# EAGLE design IOSEC8 (EAGLE 9.5.1)
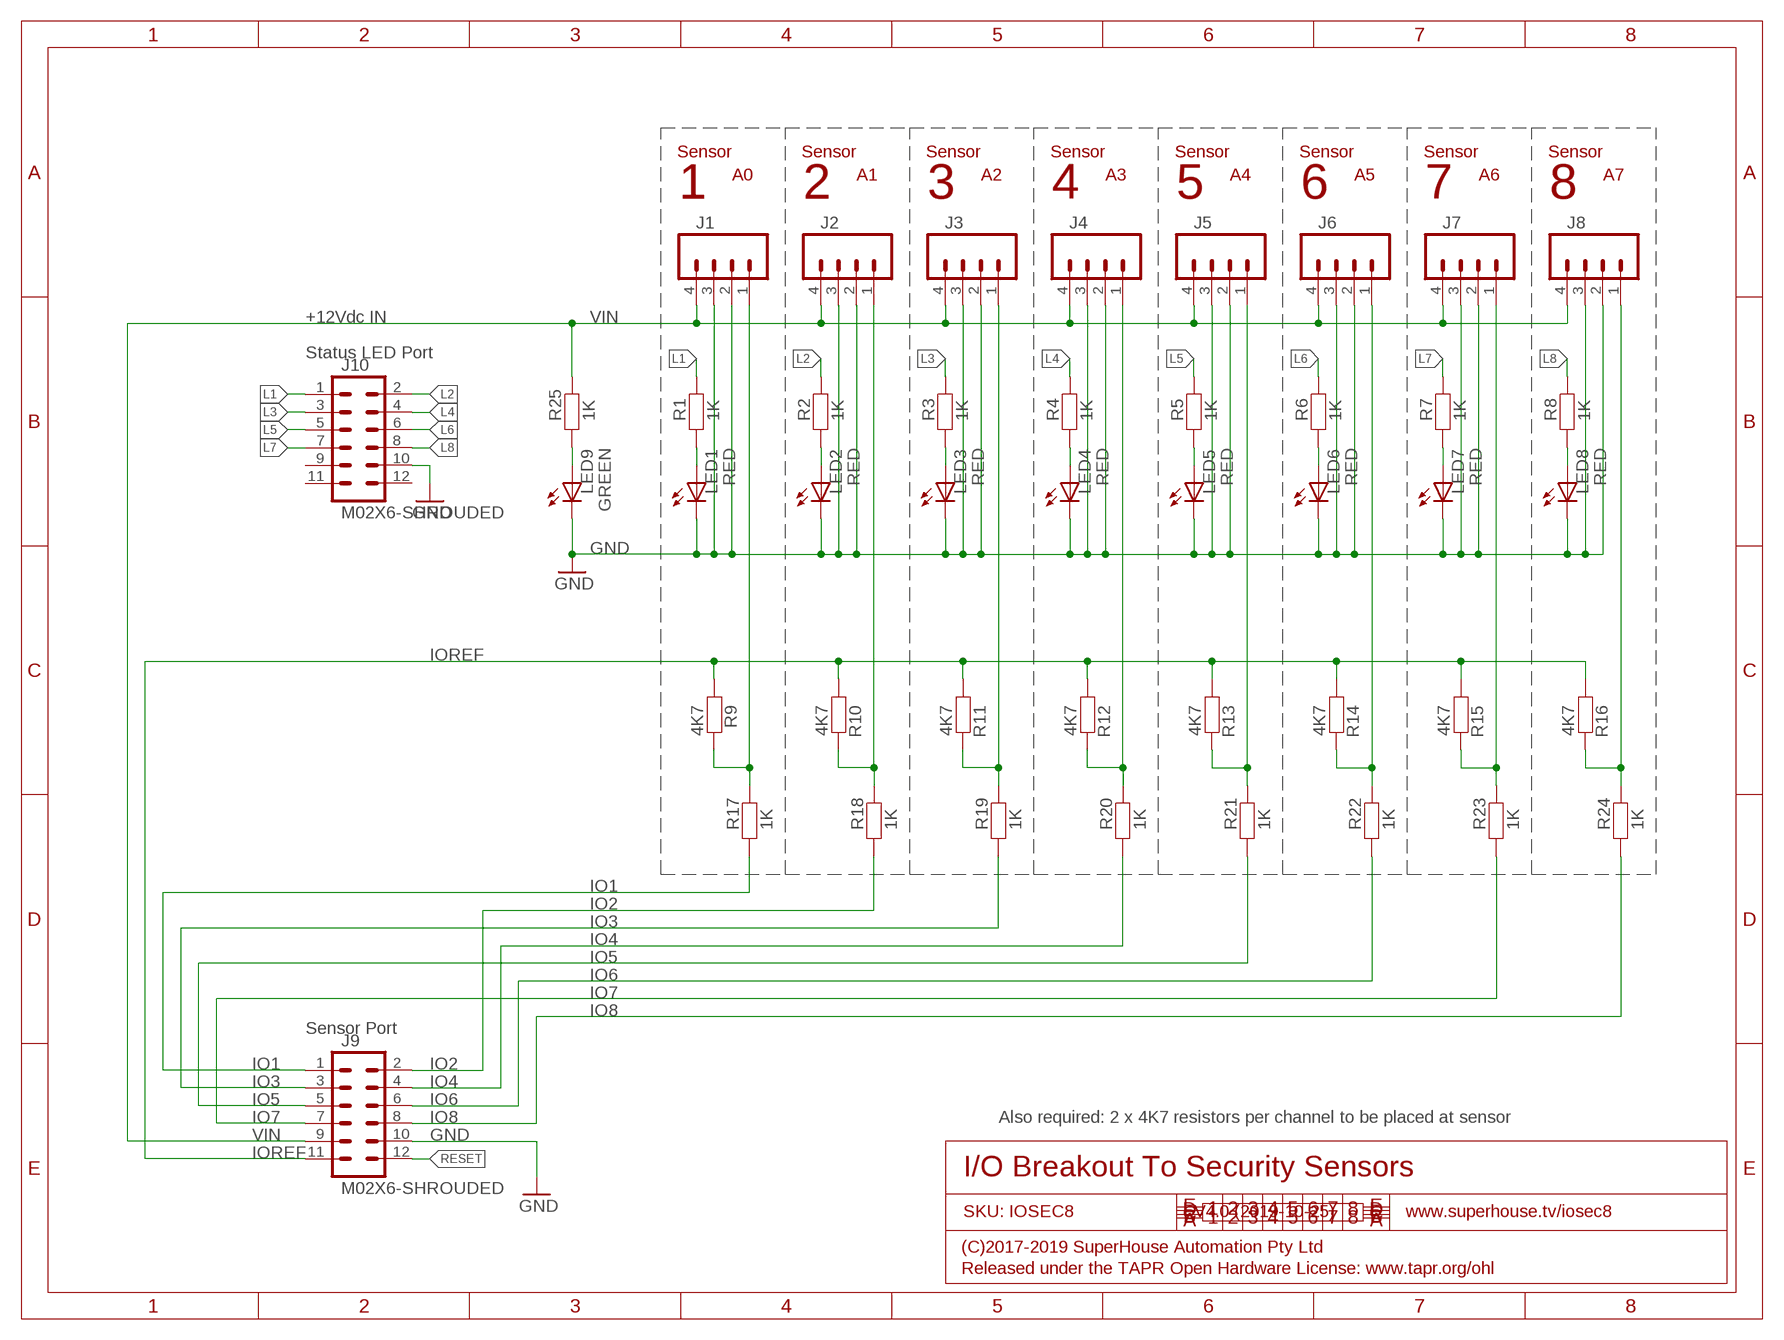
[diagram p0: schematic, sheet 1]

## Parts
J1  M04-SCREW-3.5MM  [SCREWTERMINAL-3.5MM-4]
J2  M04-SCREW-3.5MM  [SCREWTERMINAL-3.5MM-4]
J3  M04-SCREW-3.5MM  [SCREWTERMINAL-3.5MM-4]
J4  M04-SCREW-3.5MM  [SCREWTERMINAL-3.5MM-4]
J5  M04-SCREW-3.5MM  [SCREWTERMINAL-3.5MM-4]
J6  M04-SCREW-3.5MM  [SCREWTERMINAL-3.5MM-4]
J7  M04-SCREW-3.5MM  [SCREWTERMINAL-3.5MM-4]
J8  M04-SCREW-3.5MM  [SCREWTERMINAL-3.5MM-4]
J9  M02X6-SHROUDED  [2X06-SHROUDED]
J10  M02X6-SHROUDED  [2X06-SHROUDED]
LED1  RED  LED0603  [LED-0603]
LED2  RED  LED0603  [LED-0603]
LED3  RED  LED0603  [LED-0603]
LED4  RED  LED0603  [LED-0603]
LED5  RED  LED0603  [LED-0603]
LED6  RED  LED0603  [LED-0603]
LED7  RED  LED0603  [LED-0603]
LED8  RED  LED0603  [LED-0603]
LED9  GREEN  LED0603  [LED-0603]
R1  1K  RESISTOR0603  [R0603]
R2  1K  RESISTOR0603  [R0603]
R3  1K  RESISTOR0603  [R0603]
R4  1K  RESISTOR0603  [R0603]
R5  1K  RESISTOR0603  [R0603]
R6  1K  RESISTOR0603  [R0603]
R7  1K  RESISTOR0603  [R0603]
R8  1K  RESISTOR0603  [R0603]
R9  4K7  RESISTOR0603  [R0603]
R10  4K7  RESISTOR0603  [R0603]
R11  4K7  RESISTOR0603  [R0603]
R12  4K7  RESISTOR0603  [R0603]
R13  4K7  RESISTOR0603  [R0603]
R14  4K7  RESISTOR0603  [R0603]
R15  4K7  RESISTOR0603  [R0603]
R16  4K7  RESISTOR0603  [R0603]
R17  1K  RESISTOR0603  [R0603]
R18  1K  RESISTOR0603  [R0603]
R19  1K  RESISTOR0603  [R0603]
R20  1K  RESISTOR0603  [R0603]
R21  1K  RESISTOR0603  [R0603]
R22  1K  RESISTOR0603  [R0603]
R23  1K  RESISTOR0603  [R0603]
R24  1K  RESISTOR0603  [R0603]
R25  1K  RESISTOR0603  [R0603]

## Nets
GND: J1.2 J1.3 J2.2 J2.3 J3.2 J3.3 J4.2 J4.3 J5.2 J5.3 J6.2 J6.3 J7.2 J7.3 J8.2 J8.3 J9.10 J10.10 LED1.C LED2.C LED3.C LED4.C LED5.C LED6.C LED7.C LED8.C LED9.C
IO1: J9.1 R17.1
IO2: J9.2 R18.1
IO3: J9.3 R19.1
IO4: J9.4 R20.1
IO5: J9.5 R21.1
IO6: J9.6 R22.1
IO7: J9.7 R23.1
IO8: J9.8 R24.1
IOREF: J9.11 R9.1 R10.1 R11.1 R12.1 R13.1 R14.1 R15.1 R16.1
L1: J10.1 R1.2
L2: J10.2 R2.2
L3: J10.3 R3.2
L4: J10.4 R4.2
L5: J10.5 R5.2
L6: J10.6 R6.2
L7: J10.7 R7.2
L8: J10.8 R8.2
N$1: LED9.A R25.1
N$2: LED1.A R1.1
N$3: J2.1 R10.2 R18.2
N$7: J5.1 R13.2 R21.2
N$8: J6.1 R14.2 R22.2
N$9: J7.1 R15.2 R23.2
N$10: J8.1 R16.2 R24.2
N$16: LED2.A R2.1
N$17: LED3.A R3.1
N$18: LED4.A R4.1
N$19: LED5.A R5.1
N$20: LED6.A R6.1
N$21: LED7.A R7.1
N$22: LED8.A R8.1
N$249: J3.1 R11.2 R19.2
N$256: J4.1 R12.2 R20.2
N$262: J1.1 R9.2 R17.2
RESET: J9.12
VIN: J1.4 J2.4 J3.4 J4.4 J5.4 J6.4 J7.4 J8.4 J9.9 R25.2
Unconnected: J10.9 J10.11 J10.12

## Notes on the sheet
- Sensor | Sensor | Sensor | Sensor | Sensor | Sensor | Sensor | Sensor
- A0 | A1 | A2 | A3 | A4 | A5 | A6 | A7
- 1 | 2 | 3 | 4 | 5 | 6 | 7 | 8
- +12Vdc IN
- Status LED Port
- Sensor Port
- Also required: 2 x 4K7 resistors per channel to be placed at sensor
- I/O Breakout To Security Sensors
- SKU: IOSEC8 | V4.0 (2019-10-25) | www.superhouse.tv/iosec8
- (C)2017-2019 SuperHouse Automation Pty Ltd
- Released under the TAPR Open Hardware License: www.tapr.org/ohl

## Library data of the parts
J1-J8 = SuperHouse-Connectors:M04: 4-way header Standard 1x4 header, and screw terminal variations
J9 J10 = SuperHouse-Connectors:M02X6: M12 header in 2x6 format
LED1-LED9 = SuperHouse-LEDs:LED: LEDs Standard schematic elements and footprints for 5mm, 3mm, 1206, and 0603 sized LEDs. 5mm - Spark Fun Electronics SKU : COM-00529 (and others)
R1-R25 = SuperHouse-DiscreteSemi:RESISTOR: Resistor Standard resistors.

## Board
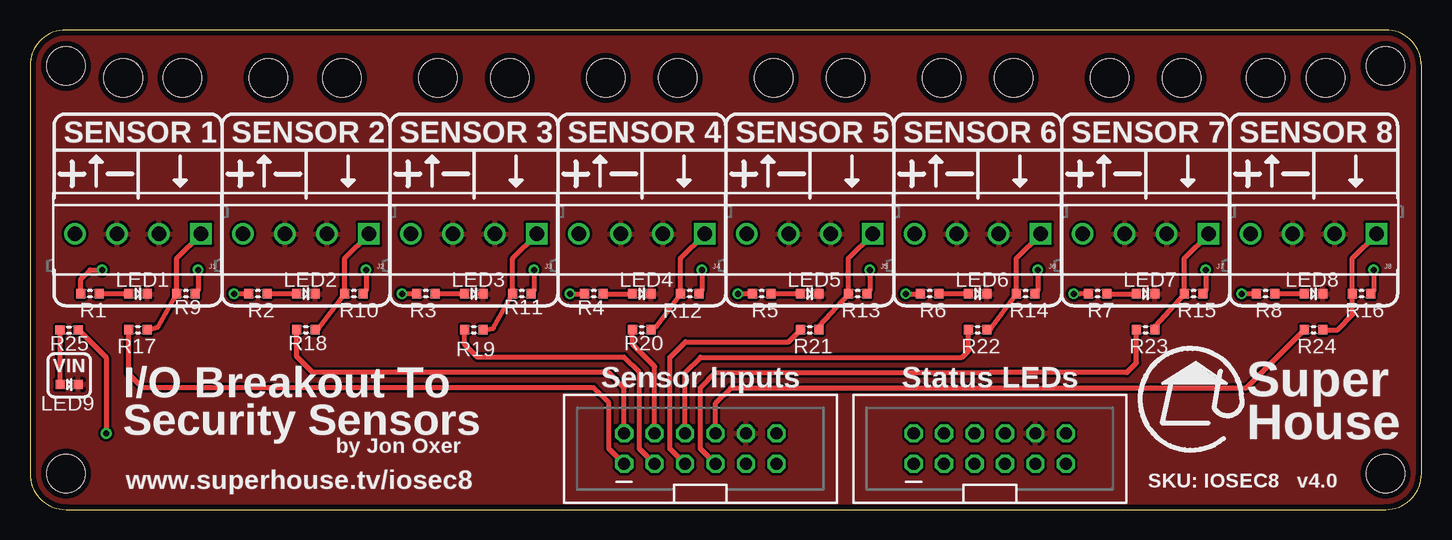
[diagram p1: board, top side]
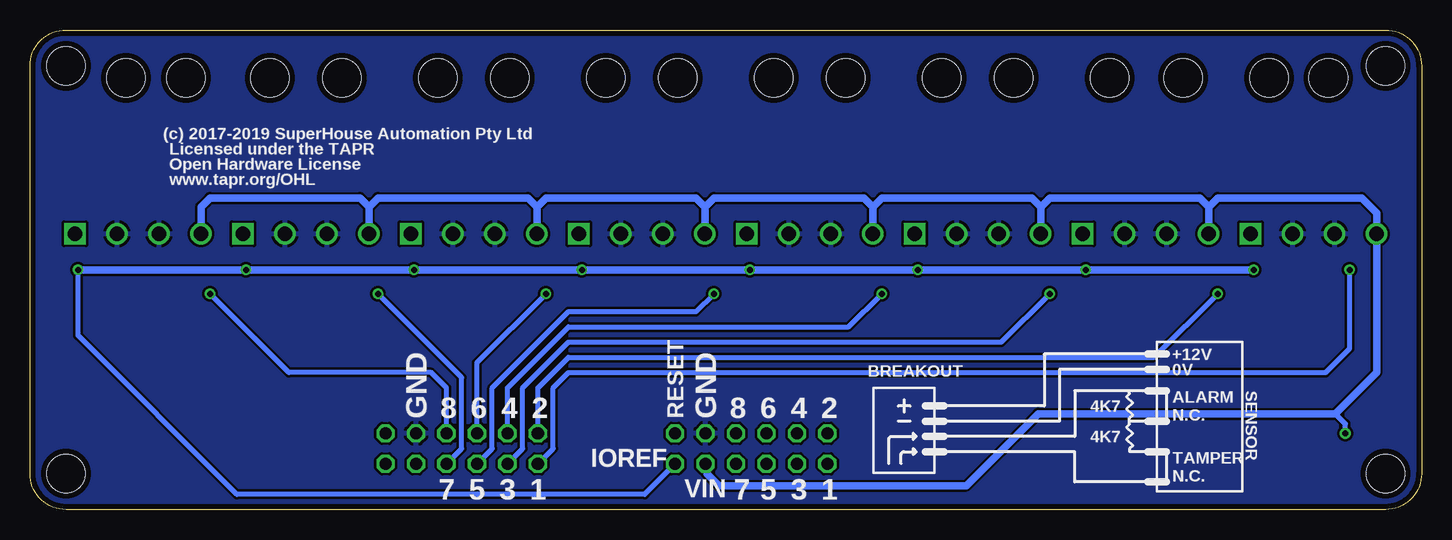
[diagram p2: board, bottom side, seen from below]

Size 116 x 40 mm. Coordinates in mm from the lower left corner, seen from the top.
Outline: 0,3 arc90 3,0 113,0 arc90 116,3 116,37 arc90 113,40 3,40 arc90 0,37 0,3
Copper layers (1*16): Top 0.035mm / dielectric 1.5mm / Bottom 0.035mm
Design rules "SuperHouse-Design-Rules": minimum track width 10mil, minimum drill 24mil, track to track 8mil, track to pad 8mil, pad to pad 8mil, via to via 8mil, smd to smd 6mil, copper to edge 18mil, drill to drill 8mil, minimum pad ring 10mil, minimum via ring 8mil, stop-mask expansion 4mil, vias tented up to drill 0.5mm, thermal gap 10mil
Holes 3.2 mm at 12.7,36 7.77,36 19.86,36 26,36 40,36 34,36 48,36 54,36 68,36 62,36 76,36 82,36 96,36 90,36 103,36 108,36 3,3 113,3 3,37 113,37

### Footprints (pad centres in the part's own frame; a part is rotated, then mirrored left to right if it is on the bottom)
SCREWTERMINAL-3.5MM-4 = drill 1.2 square: 1 -5.25,0 | drill 1.2: 2 -1.75,0; 3 1.75,0; 4 5.25,0
2X06-SHROUDED = drill 1.016 octagon: 1 0,0; 2 2.54,0; 3 0,-2.54; 4 2.54,-2.54; 5 0,-5.08; 6 2.54,-5.08; 7 0,-7.62; 8 2.54,-7.62; 9 0,-10.16; 10 2.54,-10.16; 11 0,-12.7; 12 2.54,-12.7
LED-0603 = smd 0.762 x 0.762: A -0.762,0; C 0.762,0
R0603 = smd 0.762 x 0.762: 1 -0.762,0; 2 0.762,0

### Placement (x,y rotation side)
J1  9,23 180 top
J2  23,23 180 top
J3  37,23 180 top
J4  51,23 180 top
J5  65,23 180 top
J6  79,23 180 top
J7  93,23 180 top
J8  107,23 180 top
J9  49.53,3.81 90 top
J10  73.66,3.81 90 top
LED1  9,18 0 top
LED2  23,18 0 top
LED3  37,18 0 top
LED4  51,18 0 top
LED5  65,18 0 top
LED6  79,18 0 top
LED7  93,18 0 top
LED8  107,18 0 top
LED9  3.27,10.43 0 top
R1  5,18 180 top
R2  19,18 180 top
R3  33,18 180 top
R4  47,18 180 top
R5  61,18 180 top
R6  75,18 180 top
R7  89,18 180 top
R8  103,18 180 top
R9  13,18 180 top
R10  27,18 180 top
R11  41,18 180 top
R12  55,18 180 top
R13  69,18 180 top
R14  83,18 180 top
R15  97,18 180 top
R16  111,18 180 top
R17  9,15 0 top
R18  23,15 0 top
R19  37,15 0 top
R20  51,15 0 top
R21  65,15 0 top
R22  79,15 0 top
R23  93,15 0 top
R24  107,15 0 top
R25  3.26,14.97 0 top

### Tracks (layer width: path | path; a pad name or v marks a point on that pad's centre or on a via)
GND
  pour Bottom: 0,37 arc-90 3,40 113,40 arc-90 116,37 116,3 arc-90 113,0 3,0 arc-74 0,3
  pour Top: 0,37 arc-90 3,40 113,40 arc-90 116,37 116,3 arc-90 113,0 3,0 arc-74 0,3
IO1
  Top 0.406: J9.1 48.26,5.08 48.26,8.89 46.99,10.16 9.39,10.16 8.24,11.31 R17.1
IO2
  Top 0.406: J9.2 49.53,10.16 48.26,11.43 23.57,11.43 22.24,12.76 R18.1
IO3
  Top 0.406: J9.3 50.8,5.08 50.8,11.43 49.53,12.7 39,12.7 38.54,12.7 37.3,12.7 36.24,13.76 R19.1
IO4
  Top 0.406: R20.1 50.24,13.76 52.07,11.93 J9.4
IO5
  Top 0.406: J9.5 53.34,5.08 53.34,12.7 54.64,14 63.24,14 R21.1
IO6
  Top 0.406: J9.6 54.61,11.43 55.88,12.7 77.7,12.7 78.24,13.24 R22.1
IO7
  Top 0.406: J9.7 55.88,5.08 55.88,10.16 57.15,11.43 80,11.43 91.43,11.43 92.24,12.24 R23.1
IO8
  Top 0.406: J9.8 57.15,8.89 58.42,10.16 101.4,10.16 R24.1
IOREF  (via drill 0.5)
  Top 0.305: 14,18.24 R9.1 | 28,18.24 R10.1 | 42,18.24 R11.1 | 56,18.24 R12.1 | 70,18.24 R13.1 | 84,18.24 R14.1 | 98,18.24 R15.1 | 112,18.24 R16.1
  Top 0.406: v14,20 14,18.24 | v28,20 28,18.24 | v42,20 42,18.24 | v56,20 56,18.24 | v70,20 70,18.24 | v84,20 84,18.24 | v98,20 98,18.24 | v112,20 112,18.24
  Bottom 0.406: J9.11 64.77,1.27 98.76,1.27 112,14.51 v112,20
  Bottom 0.61: v14,20 v28,20 v42,20 v56,20 v70,20 v84,20 v98,20 v112,20
L1  (via drill 0.5)
  Top 0.406: R1.2 4.24,19.24 5,20 v6,20
  Bottom 0.406: J10.1 72.39,5.08 72.39,10.16 71.12,11.43 8,11.43 6,13.43 v6,20
L2  (via drill 0.5)
  Top 0.406: R2.2 v17,18
  Bottom 0.406: J10.2 73.66,10.16 71.12,12.7 22.3,12.7 v17,18
L3  (via drill 0.5)
  Top 0.406: R3.2 v31,18
  Bottom 0.406: J10.3 74.93,5.08 74.93,10.16 71.12,13.97 37,13.97 36.45,13.97 35.03,13.97 v31,18
L4  (via drill 0.5)
  Top 0.406: v45,18 R4.2
  Bottom 0.406: J10.4 76.2,10.16 71.12,15.24 47.76,15.24 v45,18
L5  (via drill 0.5)
  Top 0.406: R5.2 v59,18
  Bottom 0.406: J10.5 77.47,5.08 77.47,10.16 71.12,16.51 64,16.51 63.8,16.51 60.49,16.51 v59,18
L6  (via drill 0.5)
  Top 0.406: v73,18 R6.2
  Bottom 0.406: J10.6 78.74,12.26 v73,18
L7  (via drill 0.5)
  Top 0.406: R7.2 87.53,18.02 v87,18
  Bottom 0.406: J10.7 80.01,5.08 80.01,11.01 v87,18
L8  (via drill 0.5)
  Top 0.406: R8.2 v101,18
  Bottom 0.406: J10.8 81.28,10.16 82.55,11.43 94.43,11.43 v101,18
N$1
  Top 0.406: LED9.A R25.1
N$2
  Top 0.406: LED1.A R1.1
N$3
  Top 0.406: R18.2 24.03,15.05 R10.2 26.24,20.99 J2.1
N$7
  Top 0.406: R21.2 65.76,15.3 R13.2 68.24,20.99 J5.1
N$8
  Top 0.406: R22.2 80.08,15.05 R14.2 82.24,20.99 J6.1
N$9
  Top 0.406: R23.2 93.76,15.28 R15.2 96.24,20.99 J7.1
N$10
  Top 0.406: J8.1 110.24,20.99 R16.2 110.24,16.24 109,15 R24.2
N$16
  Top 0.406: LED2.A R2.1
N$17
  Top 0.406: LED3.A R3.1
N$18
  Top 0.406: R4.1 LED4.A
N$19
  Top 0.406: LED5.A R5.1
N$20
  Top 0.406: LED6.A R6.1
N$21
  Top 0.406: R7.1 LED7.A
N$22
  Top 0.406: LED8.A R8.1
N$249
  Top 0.406: R19.2 38.61,15.11 R11.2 40.24,20.99 J3.1
N$256
  Top 0.406: R20.2 52.2,15.24 R12.2 54.24,20.99 J4.1
N$262
  Top 0.406: R17.2 10.67,15.24 R9.2 12.24,20.99 J1.1
VIN  (via drill 0.5)
  Top 0.406: R25.2 4.08,14.97 6.35,12.7 v6.35,6.35
  Bottom 0.406: v6.35,6.35 6.35,7.16 7.19,8
  Bottom 0.61: J9.9 59.57,3.81 59.57,3 58.57,2 37.95,2 31.95,8 7.19,8 3.75,11.44 J1.4 3.75,24.75 5,26 17,26 17.75,25.25 | J4.4 45.75,25.25 | 45.75,25.25 45,26 32.5,26 31.75,25.25 | J5.4 59.75,25.25 | 59.75,25.25 59,26 46.5,26 45.75,25.25 | J6.4 73.75,25.25 | 73.75,25.25 73,26 60.5,26 59.75,25.25 | J7.4 87.75,25.25 | 87.75,25.25 87,26 74.5,26 73.75,25.25 | J8.4 101.75,25.25 101,26 88.5,26 87.75,25.25 | J3.4 31.75,25.25 | 31.75,25.25 31,26 18.5,26 17.75,25.25 | J2.4 17.75,25.25

### Text on the board
tPlace: SENSOR 1 | SENSOR 2 | SENSOR 3 | SENSOR 4 | SENSOR 5 | SENSOR 6 | SENSOR 7 | SENSOR 8 | VIN | Sensor Inputs | Status LEDs | I/O Breakout To / Security Sensors | Super / House | by Jon Oxer | www.superhouse.tv/iosec8 | SKU: IOSEC8 | v4.0
bPlace: (c) 2017-2019 SuperHouse Automation Pty Ltd | Licensed under the TAPR | Open Hardware License | www.tapr.org/OHL | +12V | 0V | BREAKOUT | SENSOR | 4K7 | 2 | 4 | 6 | 8 | GND | RESET | 2 | 4 | 6 | 8 | GND | ALARM / N.C. | 4K7 | IOREF | 1 | 3 | 5 | 7 | VIN | 1 | 3 | 5 | 7 | TAMPER / N.C.
tDocu: A | K | A | K | A | K | A | K | A | K | A | K | A | K | A | K | A | K